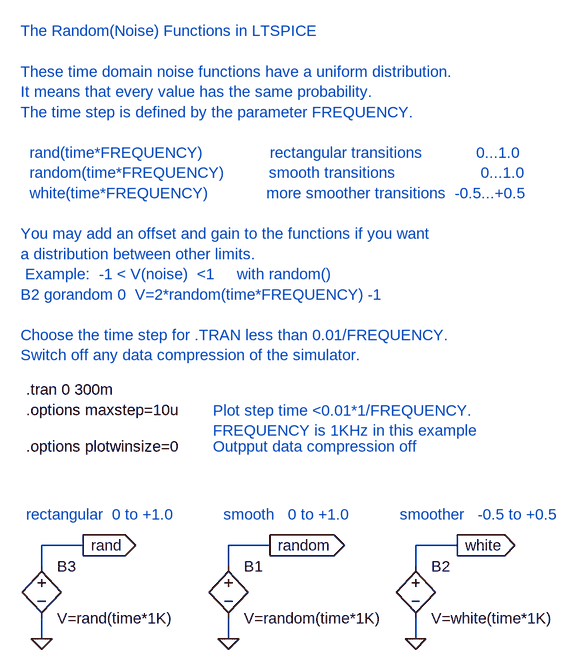
[diagram p0: schematic randrandomwhite.asc]
randrandomwhite.asc, the LTspice schematic file:
Version 4
SHEET 1 1652 680
WIRE 304 192 304 224
WIRE 592 192 592 224
WIRE 16 192 16 224
WIRE 16 112 16 80
WIRE 592 112 592 80
WIRE 304 112 304 80
WIRE 592 80 656 80
WIRE 304 80 368 80
WIRE 16 80 80 80
FLAG 304 224 0
FLAG 592 224 0
FLAG 16 224 0
FLAG 368 80 random
IOPIN 368 80 Out
FLAG 656 80 white
IOPIN 656 80 Out
FLAG 80 80 rand
IOPIN 80 80 Out
SYMBOL bv 304 96 R0
SYMATTR InstName B1
SYMATTR Value V=random(time*1K)
SYMBOL bv 592 96 R0
SYMATTR InstName B2
SYMATTR Value V=white(time*1K)
SYMBOL bv 16 96 R0
SYMATTR InstName B3
SYMATTR Value V=rand(time*1K)
TEXT -8 -160 Left 0 !.tran 0 300m\n.options maxstep=10u
TEXT -8 32 Left 0 ;rectangular  0 to +1.0
TEXT 296 32 Left 0 ;smooth   0 to +1.0
TEXT 568 32 Left 0 ;smoother   -0.5 to +0.5
TEXT -16 -712 Left 0 ;The Random(Noise) Functions in LTSPICE\n \nThese time domain noise functions have a uniform distribution.\nIt means that every value has the same probability.\nThe time step is defined by the parameter FREQUENCY.\n \n  rand(time*FREQUENCY)               rectangular transitions            0...1.0\n  random(time*FREQUENCY)          smooth transitions                   0...1.0\n  white(time*FREQUENCY)             more smoother transitions  -0.5...+0.5   \n \nYou may add an offset and gain to the functions if you want \na distribution between other limits.\n Example:  -1 < V(noise)  <1     with random()\nB2 gorandom 0  V=2*random(time*FREQUENCY) -1\n \nChoose the time step for .TRAN less than 0.01/FREQUENCY.\nSwitch off any data compression of the simulator.
TEXT -8 -72 Left 0 !.options plotwinsize=0
TEXT 280 -72 Left 0 ;Outpput data compression off
TEXT 280 -128 Left 0 ;Plot step time <0.01*1/FREQUENCY. \nFREQUENCY is 1KHz in this example

The netlist it stands for:
* randrandomwhite.asc
B1 random 0 V=random(time*1K)
B2 white 0 V=white(time*1K)
B3 rand 0 V=rand(time*1K)
.tran 0 300m
.options maxstep=10u
* rectangular  0 to +1.0
* smooth   0 to +1.0
* smoother   -0.5 to +0.5
* The Random(Noise) Functions in LTSPICE
* These time domain noise functions have a uniform distribution.
* It means that every value has the same probability.
* The time step is defined by the parameter FREQUENCY.
*   rand(time*FREQUENCY)               rectangular transitions            0...1.0
*   random(time*FREQUENCY)          smooth transitions                   0...1.0
*   white(time*FREQUENCY)             more smoother transitions  -0.5...+0.5
* You may add an offset and gain to the functions if you want
* a distribution between other limits.
*  Example:  -1 < V(noise)  <1     with random()
* B2 gorandom 0  V=2*random(time*FREQUENCY) -1
* Choose the time step for .TRAN less than 0.01/FREQUENCY.
* Switch off any data compression of the simulator.
.options plotwinsize=0
* Outpput data compression off
* Plot step time <0.01*1/FREQUENCY.
* FREQUENCY is 1KHz in this example
.backanno
.end